# EAGLE design badge (EAGLE 8.5.1)
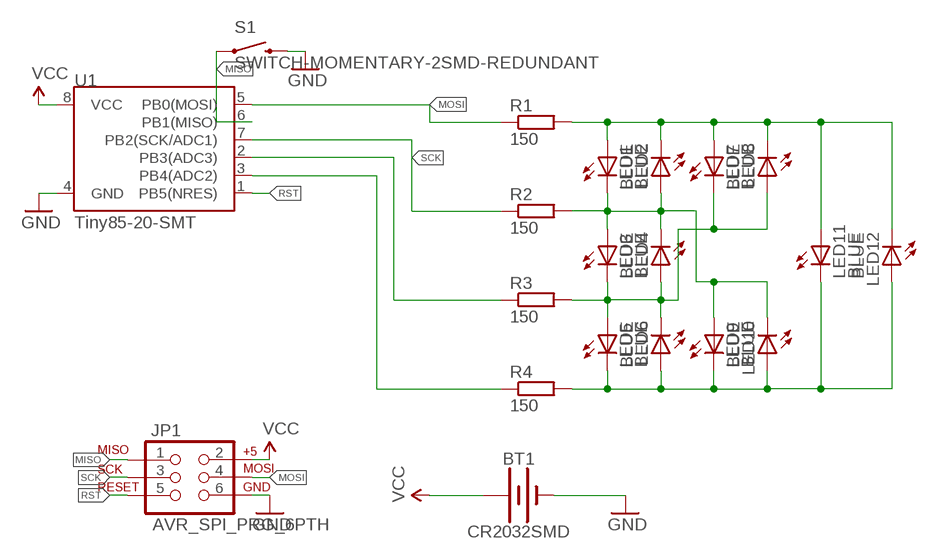
[diagram p0: schematic, sheet 1]

## Parts
BT1  CR2032SMD  BATTERY-20MM_SMD_4LEGS  [BATTCON_20MM_4LEGS]
JP1  AVR_SPI_PRG_6PTH  [2X3]
LED1  BLUE  LEDCHIP-LED0805  [CHIP-LED0805]
LED2  BLUE  LEDCHIP-LED0805  [CHIP-LED0805]
LED3  BLUE  LEDCHIP-LED0805  [CHIP-LED0805]
LED4  BLUE  LEDCHIP-LED0805  [CHIP-LED0805]
LED5  BLUE  LEDCHIP-LED0805  [CHIP-LED0805]
LED6  BLUE  LEDCHIP-LED0805  [CHIP-LED0805]
LED7  BLUE  LEDCHIP-LED0805  [CHIP-LED0805]
LED8  BLUE  LEDCHIP-LED0805  [CHIP-LED0805]
LED9  BLUE  LEDCHIP-LED0805  [CHIP-LED0805]
LED10  BLUE  LEDCHIP-LED0805  [CHIP-LED0805]
LED11  BLUE  LEDCHIP-LED0805  [CHIP-LED0805]
LED12  BLUE  LEDCHIP-LED0805  [CHIP-LED0805]
R1  150  R-EU_R0805  [R0805]
R2  150  R-EU_R0805  [R0805]
R3  150  R-EU_R0805  [R0805]
R4  150  R-EU_R0805  [R0805]
S1  SWITCH-MOMENTARY-2SMD-REDUNDANT  [TACTILE-SWITCH-SMD]
U1  Tiny85-20-SMT  ATTINY45TINY85-20-SMT  [SO08-EIAJ]

## Nets
GND: BT1.NEGATIVE(GND) JP1.6 S1.3 S1.4 U1.4(GND)
MISO: JP1.1 S1.1 S1.2 U1.6(PB1(MISO))
MOSI: JP1.4 R1.1 U1.5(PB0(MOSI))
N$1: R4.1 U1.3(PB4(ADC2))
N$2: LED5.C LED6.A LED9.C LED10.A LED11.C LED12.A R4.2
N$9: LED1.A LED2.C LED7.A LED8.C LED11.A LED12.C R1.2
N$11: LED1.C LED2.A LED3.A LED4.C LED9.A LED10.C R2.2
N$12: LED3.C LED4.A LED5.A LED6.C LED7.C LED8.A R3.2
PB3: R3.1 U1.2(PB3(ADC3))
RST: JP1.5 U1.1(PB5(NRES))
SCK: JP1.3 R2.1 U1.7(PB2(SCK/ADC1))
VCC: BT1.POSITIVE@1(VCC) BT1.POSITIVE@2(VCC) BT1.POSITIVE@3(VCC) BT1.POSITIVE@4(VCC) JP1.2 U1.8(VCC)

## Library data of the parts
BT1 = SparkFun-Batteries:BATTERY: Battery - Single Cell A variety of battery chemistries, sizes, and footprints. Device List: 20MM_PTH - Coin Cell Battery Holder - 20mm (PTH) <https://www.sparkfun.com/products/783> 6.8MM_PTH - Coin Cell Battery Holder - 6.8MM(SMD) <https://www.digikey.com/product-detail/en/seiko-instruments/MS621FE-FL11E/728-1057-ND/1889208?WT.srch=1&gclid=CNOQ5a6LzdQCFZS2wAodXCkE0g> 12MM_SMD - Coin Cell Battery Holder - 12mm (SMD) <https://www.sparkfun.com/products/10592> 12MM_PTH - Coin Cell Battery Holder - 12mm (PTH) <https://www.sparkfun.com/products/7948> 20MM_SMD - 20mm Coin Cell Battery Holder (SMD) (2 legs) Used on the Big Time Watch Kit <https://www.sparkfun.com/products/11734> 20MM_SMD_4LEGS - Coin Cell Battery Holder - 20mm (SMD) <https://www.sparkfun.com/products/11892> 20MM_SMD_4LEGS_OVERPASTE - Coin Cell Battery Holder - 20mm (SMD) <https://www.sparkfun.com/products/11892> (Over-paste on the legs) 24.5MM_PTH - Coin Cell Battery Holder - 24.5mm (PTH) <https://www.sparkfun.com/products/8863> 9V - 9V Battery Holder - PC Mount Used on the SparkFun SparkPunk Sound Kit <https://www.sparkfun.com/products/11177> and SparkFun SparkPunk Sequencer Kit <https://www.sparkfun.com/products/12707> 18650 - Battery Holder - 18650 (PTH) <https://www.sparkfun.com/products/13113> AA - Battery Holder - 1xAA (PTH) <https://www.sparkfun.com/products/7949> AAA - Battery Holder - 1xAAA (PTH) <https://www.sparkfun.com/products/12718> AA_KIT - Battery Holder - 1xAA (PTH) <https://www.sparkfun.com/products/7949> Special kit package - pads only have exposed copper on one side of the board. AAA_KIT - Battery Holder - 1xAAA (PTH) <https://www.sparkfun.com/products/12718> Special kit package - pads only have exposed copper on one side of the board.; PROD_ID: BATT-10373; SF_SKU: PRT-11892
JP1 = SparkFun-Connectors:AVR_SPI_PRG_6: AVR ISP 6 Pin This is the reduced ISP connector for AVR programming. Common on Arduino. This footprint will take up less PCB space and can be used with a 10-pin to 6-pin adapter such as SKU: BOB-08508 **Special note about "TEST_POINT" package. The stop mask is on the top side, so if you want your programming test points to be on the bottom of your board, make sure to place this package on the bottom side of the board. This also ensure that the orientation to program from the bottom side will be correct.
LED1-LED12 = led:LED: LED OSRAM: - CHIPLED LG R971, LG N971, LY N971, LG Q971, LY Q971, LO R971, LY R971 LH N974, LH R974 LS Q976, LO Q976, LY Q976 LO Q996 - Hyper CHIPLED LW Q18S LB Q993, LB Q99A, LB R99A - SideLED LS A670, LO A670, LY A670, LG A670, LP A670 LB A673, LV A673, LT A673, LW A673 LH A674 LY A675 LS A676, LA A676, LO A676, LY A676, LW A676 LS A679, LY A679, LG A679 - Hyper Micro SIDELED® LS Y876, LA Y876, LO Y876, LY Y876 LT Y87S - SmartLED LW L88C, LW L88S LB L89C, LB L89S, LG L890 LS L89K, LO L89K, LY L89K LS L896, LA L896, LO L896, LY L896 - TOPLED LS T670, LO T670, LY T670, LG T670, LP T670 LSG T670, LSP T670, LSY T670, LOP T670, LYG T670 LG T671, LOG T671, LSG T671 LB T673, LV T673, LT T673, LW T673 LH T674 LS T676, LA T676, LO T676, LY T676, LB T676, LH T676, LSB T676, LW T676 LB T67C, LV T67C, LT T67C, LS T67K, LO T67K, LY T67K, LW E67C LS E67B, LA E67B, LO E67B, LY E67B, LB E67C, LV E67C, LT E67C LW T67C LS T679, LY T679, LG T679 LS T770, LO T770, LY T770, LG T770, LP T770 LB T773, LV T773, LT T773, LW T773 LH T774 LS E675, LA E675, LY E675, LS T675 LS T776, LA T776, LO T776, LY T776, LB T776 LHGB T686 LT T68C, LB T68C - Hyper Mini TOPLED® LB M676 - Mini TOPLED Santana® LG M470 LS M47K, LO M47K, LY M47K Source: http://www.osram.convergy.de LUXEON: - LUMILED® LXK2-PW12-R00, LXK2-PW12-S00, LXK2-PW14-U00, LXK2-PW14-V00 LXK2-PM12-R00, LXK2-PM12-S00, LXK2-PM14-U00 LXK2-PE12-Q00, LXK2-PE12-R00, LXK2-PE12-S00, LXK2-PE14-T00, LXK2-PE14-U00 LXK2-PB12-K00, LXK2-PB12-L00, LXK2-PB12-M00, LXK2-PB14-N00, LXK2-PB14-P00, LXK2-PB14-Q00 LXK2-PR12-L00, LXK2-PR12-M00, LXK2-PR14-Q00, LXK2-PR14-R00 LXK2-PD12-Q00, LXK2-PD12-R00, LXK2-PD12-S00 LXK2-PH12-R00, LXK2-PH12-S00 LXK2-PL12-P00, LXK2-PL12-Q00, LXK2-PL12-R00 Source: www.luxeon.com KINGBRIGHT: KA-3528ASYC Source: www.kingbright.com
R1-R4 = rcl:R-EU_: RESISTOR, European symbol
S1 = SparkFun-Electromechanical:SWITCH-MOMENTARY-2: Various NO switches- pushbuttons, reed, etc
U1 = SparkFun-DigitalIC:ATTINY45: Atmel 8-pin 2/4/8kB flash uC; PROD_ID: IC-09092

## Board
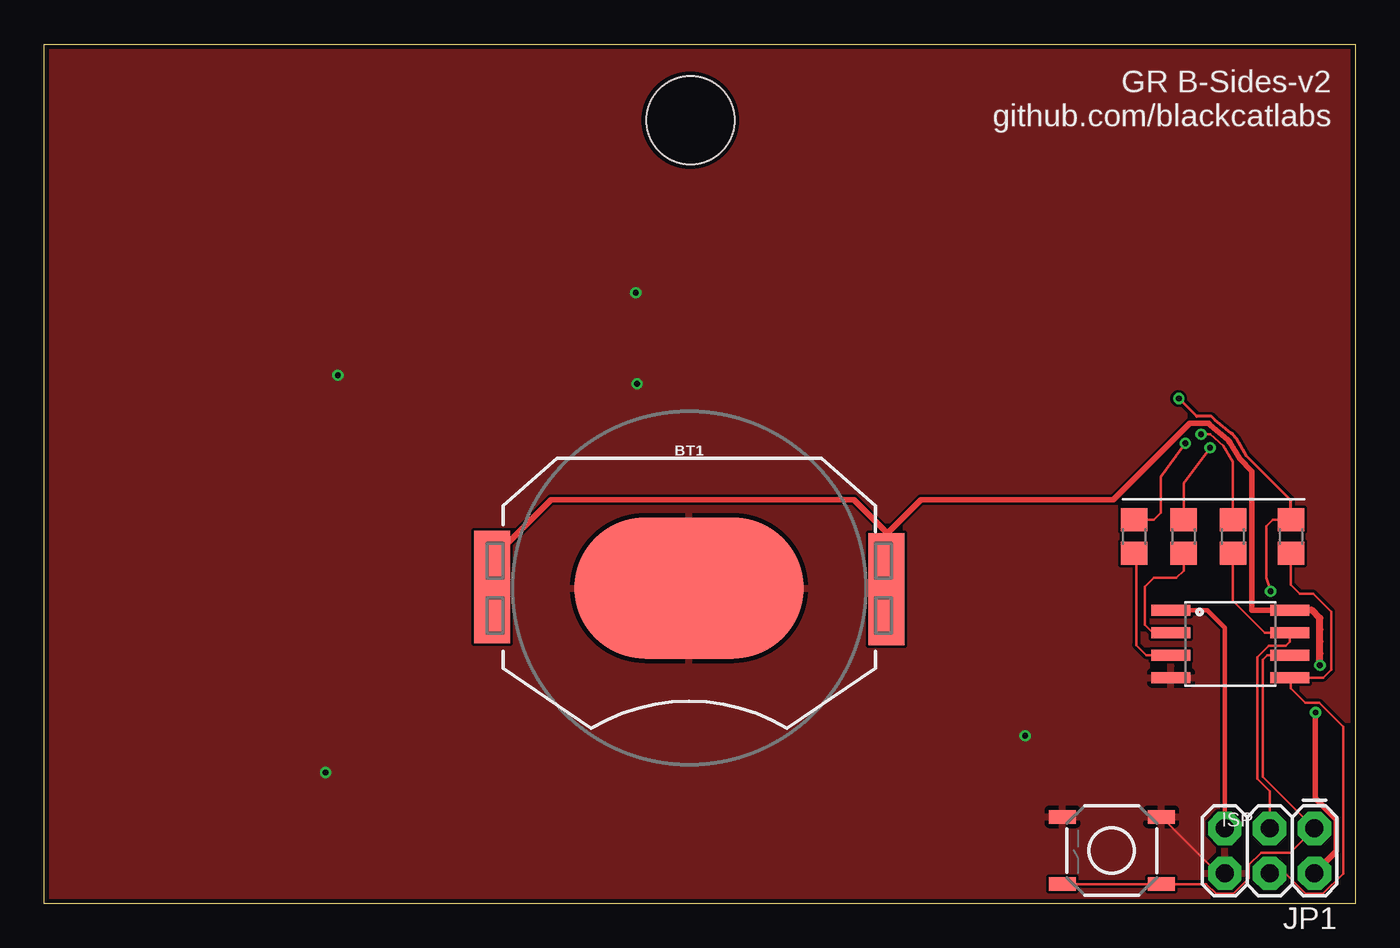
[diagram p1: board, top side]
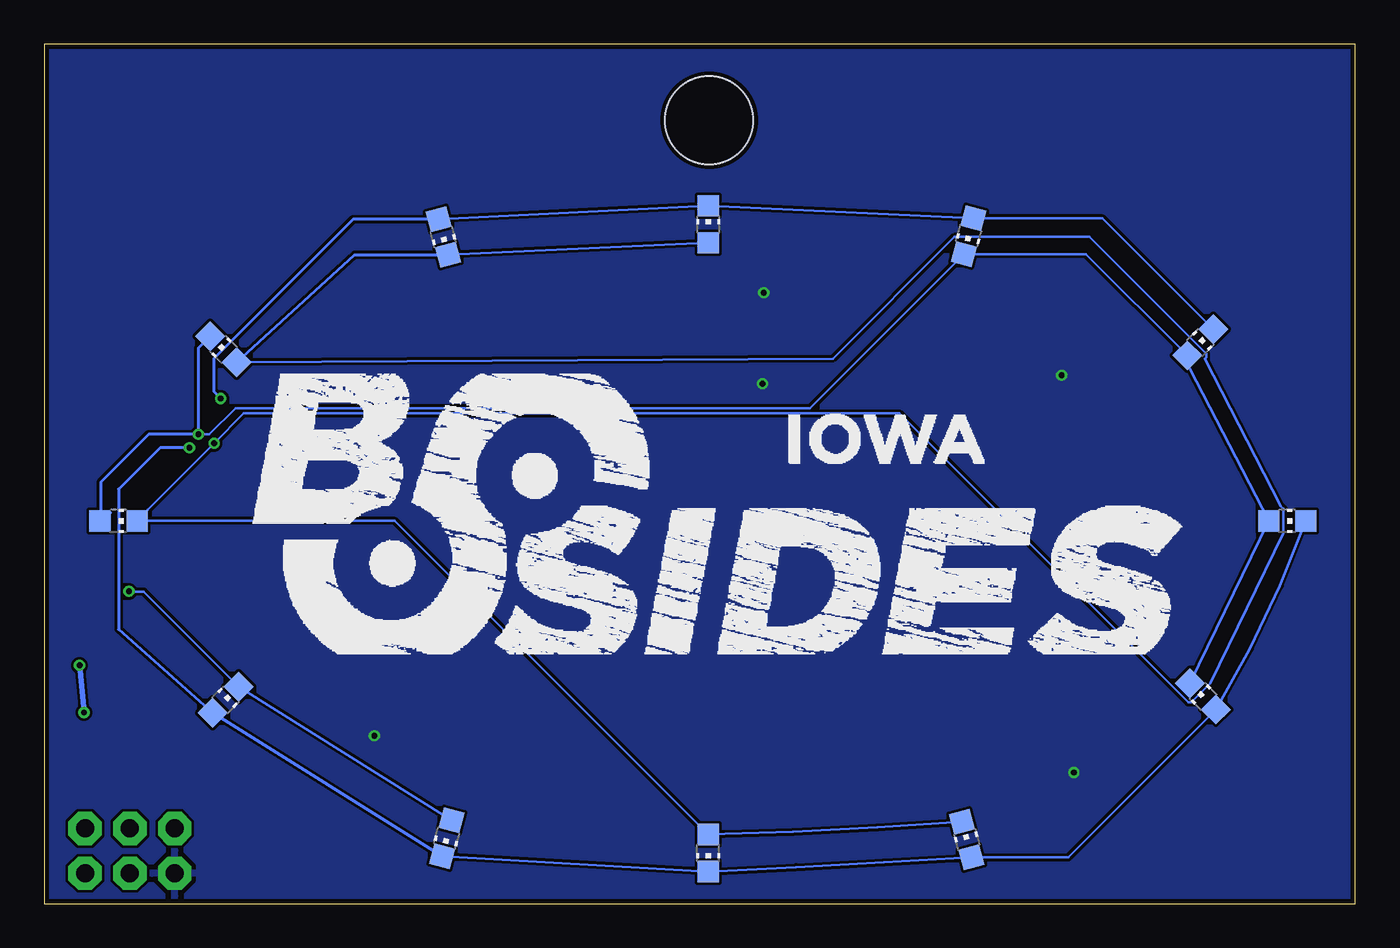
[diagram p2: board, bottom side, seen from below]

Size 74.27 x 48.66 mm. Coordinates in mm from the lower left corner, seen from the top.
Outline: 0,0 0,48.66 74.28,48.66 74.28,0 0,0
Copper layers (1*16): Top 0.035mm / dielectric 1.5mm / Bottom 0.035mm
Design rules "SeeedStudio_2layer_DRU_no_angle_20140221": minimum track width 6mil, minimum drill 12mil, track to track 6mil, track to pad 6mil, pad to pad 6mil, via to via 6mil, smd to smd 0mil, copper to edge 10mil, drill to drill 10mil, minimum pad ring 10mil, minimum via ring 6mil, stop-mask expansion 2mil, vias tented up to drill 100mil, thermal gap 10mil
Holes 5 mm at 36.6,44.35

### Footprints (pad centres in the part's own frame; a part is rotated, then mirrored left to right if it is on the bottom)
BATTCON_20MM_4LEGS = smd 13 x 8: NEGATIVE 0,0 | smd 2.032 x 3.175: POSITIVE@1 -11.176,1.651; POSITIVE@2 -11.176,-1.524; POSITIVE@3 11.176,1.524; POSITIVE@4 11.176,-1.651
2X3 = drill 1.016 pad 1.88 octagon: 1 0,0; 2 0,2.54; 3 2.54,0; 4 2.54,2.54; 5 5.08,0; 6 5.08,2.54
CHIP-LED0805 = smd 1.2 x 1.2: A 0,-1.05; C 0,1.05
R0805 = smd 1.3 x 1.5: 1 -0.95,0; 2 0.95,0
TACTILE-SWITCH-SMD = smd 1.524 x 0.762: 1 -2.794,1.905; 2 2.794,1.905; 3 -2.794,-1.905; 4 2.794,-1.905
SO08-EIAJ = smd 0.61 x 2.21: 1 -1.905,-3.378; 2 -0.635,-3.378; 3 0.635,-3.378; 4 1.905,-3.378; 5 1.905,3.353; 6 0.635,3.353; 7 -0.635,3.353; 8 -1.905,3.353

### Placement (x,y rotation side)
BT1  36.54,17.86 0 top
JP1  71.96,4.25 180 top
LED1  21.9,37.79 165 bottom
LED2  8.78,31.77 315 bottom
LED3  3.86,21.66 270 bottom
LED4  8.64,11.73 45 bottom
LED5  22.01,3.63 15 bottom
LED6  36.66,2.86 180 bottom
LED7  51.47,3.69 165 bottom
LED8  63.99,11.54 315 bottom
LED9  70.06,21.66 270 bottom
LED10  64.12,31.38 45 bottom
LED11  51.66,37.74 195 bottom
LED12  36.66,38.46 0 bottom
R1  70.63,20.79 90 top
R2  67.33,20.79 90 top
R3  64.55,20.79 90 top
R4  61.73,20.79 90 top
S1  60.48,3.01 180 top
U1  67.21,14.69 270 top

### Tracks (layer width: path | path; a pad name or v marks a point on that pad's centre or on a via)
GND  (via drill 0.33)
  Top 0.152: S1.3 66.47,1.71 JP1.6
  other vias: 16.64,29.92 33.59,29.43 55.56,9.5 15.95,7.42 33.52,34.58
  pour Bottom (isolate 0.152): -0.34,49.95 75.66,49.95 75.66,-1.01 -0.34,-1.01
  pour Top (isolate 0.152): -0.66,49.32 75.63,49.32 75.63,-1.23 -0.66,-1.23
MISO
  Top 0.152: U1.6 69.29,14.06 69.03,13.81 69.03,7.18 JP1.1 70.59,2.88 68.93,2.88 68.25,2.2 68.25,1.43 67.36,0.54 66.39,0.54 65.84,1.1 S1.1 S1.2
MOSI
  Top 0.152: U1.5 70.63,12.79 | 70.63,12.79 72.46,12.79 72.9,13.23 72.9,16.54 71.89,17.55 71.13,17.55 70.62,18.06 70.62,19.83 R1.1 | JP1.4 70.31,1.71 71.47,0.54 72.44,0.54 73.58,1.69 73.58,10.02 72.24,11.37 71.45,11.37 70.63,12.19 70.63,12.79
N$1
  Top 0.152: R4.1 61.85,19.72 61.85,14.63 62.43,14.06 U1.3
N$2  (via drill 0.33)
  Top 0.152: R4.2 62.87,21.74 63.25,22.12 63.25,24.16 v64.65,26.06
  Bottom 0.152: LED5.C arc3 LED6.A 54.41,21.66 LED9.C 68.41,22.3 v64.65,26.06 62.96,27.75 25.83,27.75 9.47,11.39 9.28,11.39 8.22,12.46 4.08,20.97 4.08,22.36 4.22,22.49 8.54,30.85 8.45,30.94 8.45,31.13 15.07,37.75 22.7,37.75 29.6,30.86 LED10.A | LED12.A LED11.C
  Bottom 0.18: LED10.A 56.69,36.73 LED11.C
N$9  (via drill 0.33)
  Top 0.152: 70.11,21.74 R1.2 70.12,21.74 69.6,21.74 69.22,21.36 69.22,18.44 arc2 v69.47,17.68
  Top 0.18: v64.27,28.6 65.29,27.58 66.12,27.58 66.33,27.38 67.24,26.62 67.31,26.6 67.36,26.52 67.43,26.46 67.48,26.38 67.55,26.32 68.12,25.33 70.63,22.82 R1.2
  Bottom 0.152: LED2.C 14.32,38.8 LED1.A LED12.C LED11.A | 69.47,17.46 69.47,17.66 | 69.47,17.66 v69.47,17.68 | 69.47,17.66 68.63,17.66 LED8.C LED7.A
  Bottom 0.18: LED11.A 56.77,38.75 64.66,30.86 64.66,28.99 v64.27,28.6 | 69.23,17.66 69.47,17.66
N$11  (via drill 0.33)
  Top 0.152: R2.2 67.33,25.03 66.81,25.93 66.05,26.57 v65.54,26.57
  Bottom 0.152: LED4.C LED3.A 9.73,30.99 LED2.A 15.27,36.77 LED1.C 30.89,28.05 63.43,28.05 64.91,26.57 v65.54,26.57 65.54,26.66 | 70.51,22.11 LED9.A
  Bottom 0.18: LED10.C 65.54,31.45 v65.54,26.57 68.35,26.57 71.06,23.86 71.06,21.71 LED9.A
N$12  (via drill 0.33)
  Top 0.152: v66.05,25.81 64.55,23.8 R3.2
  Bottom 0.152: LED3.C arc11 LED4.A 16.27,2.61 LED5.A arc0 LED6.C LED7.C | 66.05,25.55 v66.05,25.81
  Bottom 0.18: v66.05,25.81 67.71,25.81 70.06,23.46 70.06,15.52 LED8.A LED7.C
PB3
  Top 0.152: R3.1 64.55,18.85 64.14,18.44 62.87,18.44 62.36,17.93 62.36,15.77 62.81,15.33 U1.2
RST
  Top 0.152: 64.27,16.54 U1.1
  Top 0.254: U1.1 65.89,16.6 66.88,15.61 JP1.5
  Top 0.305: 64.42,16.59 64.36,16.6 64.27,16.54
SCK
  Top 0.152: R2.1 67.33,17.15 69.16,15.33 U1.7 | 71,15.27 U1.7 | U1.7 70.56,14.83 70.32,14.59 69.36,14.59 68.73,13.96 68.73,7.05 69.42,6.36 JP1.3
VCC  (via drill 0.33)
  Top 0.152: v72.01,10.82 72.01,10.95 72.12,11.05 72.12,10.93 v72.01,10.82
  Top 0.3: U1.8 68.42,16.6 68.42,24.47 67.72,25.17 67.17,26.12 67.1,26.18 67.06,26.26 66.06,27.09 65.96,27.19 64.9,27.19 60.57,22.86 49.66,22.86 47.76,20.96 | 47.76,20.96 47.72,20.92 BT1.POSITIVE@3 BT1.POSITIVE@4 | BT1.POSITIVE@2 BT1.POSITIVE@1 28.71,22.86 45.86,22.86 47.76,20.96
  Top 0.305: v72.01,10.82 72.01,5.96 73.2,4.77 73.2,2.96 JP1.2
  Top 0.406: v72.27,13.49 arc-2 72.27,15.52 72.27,16.15 71.82,16.6 U1.8
  Bottom 0.3: v72.01,10.82 v72.27,13.49

### Text on the board
tPlace: GR B-Sides-v2 / github.com/blackcatlabs
tNames: ISP